# EAGLE schematic driver_piezo2 (EAGLE 7.1.0)
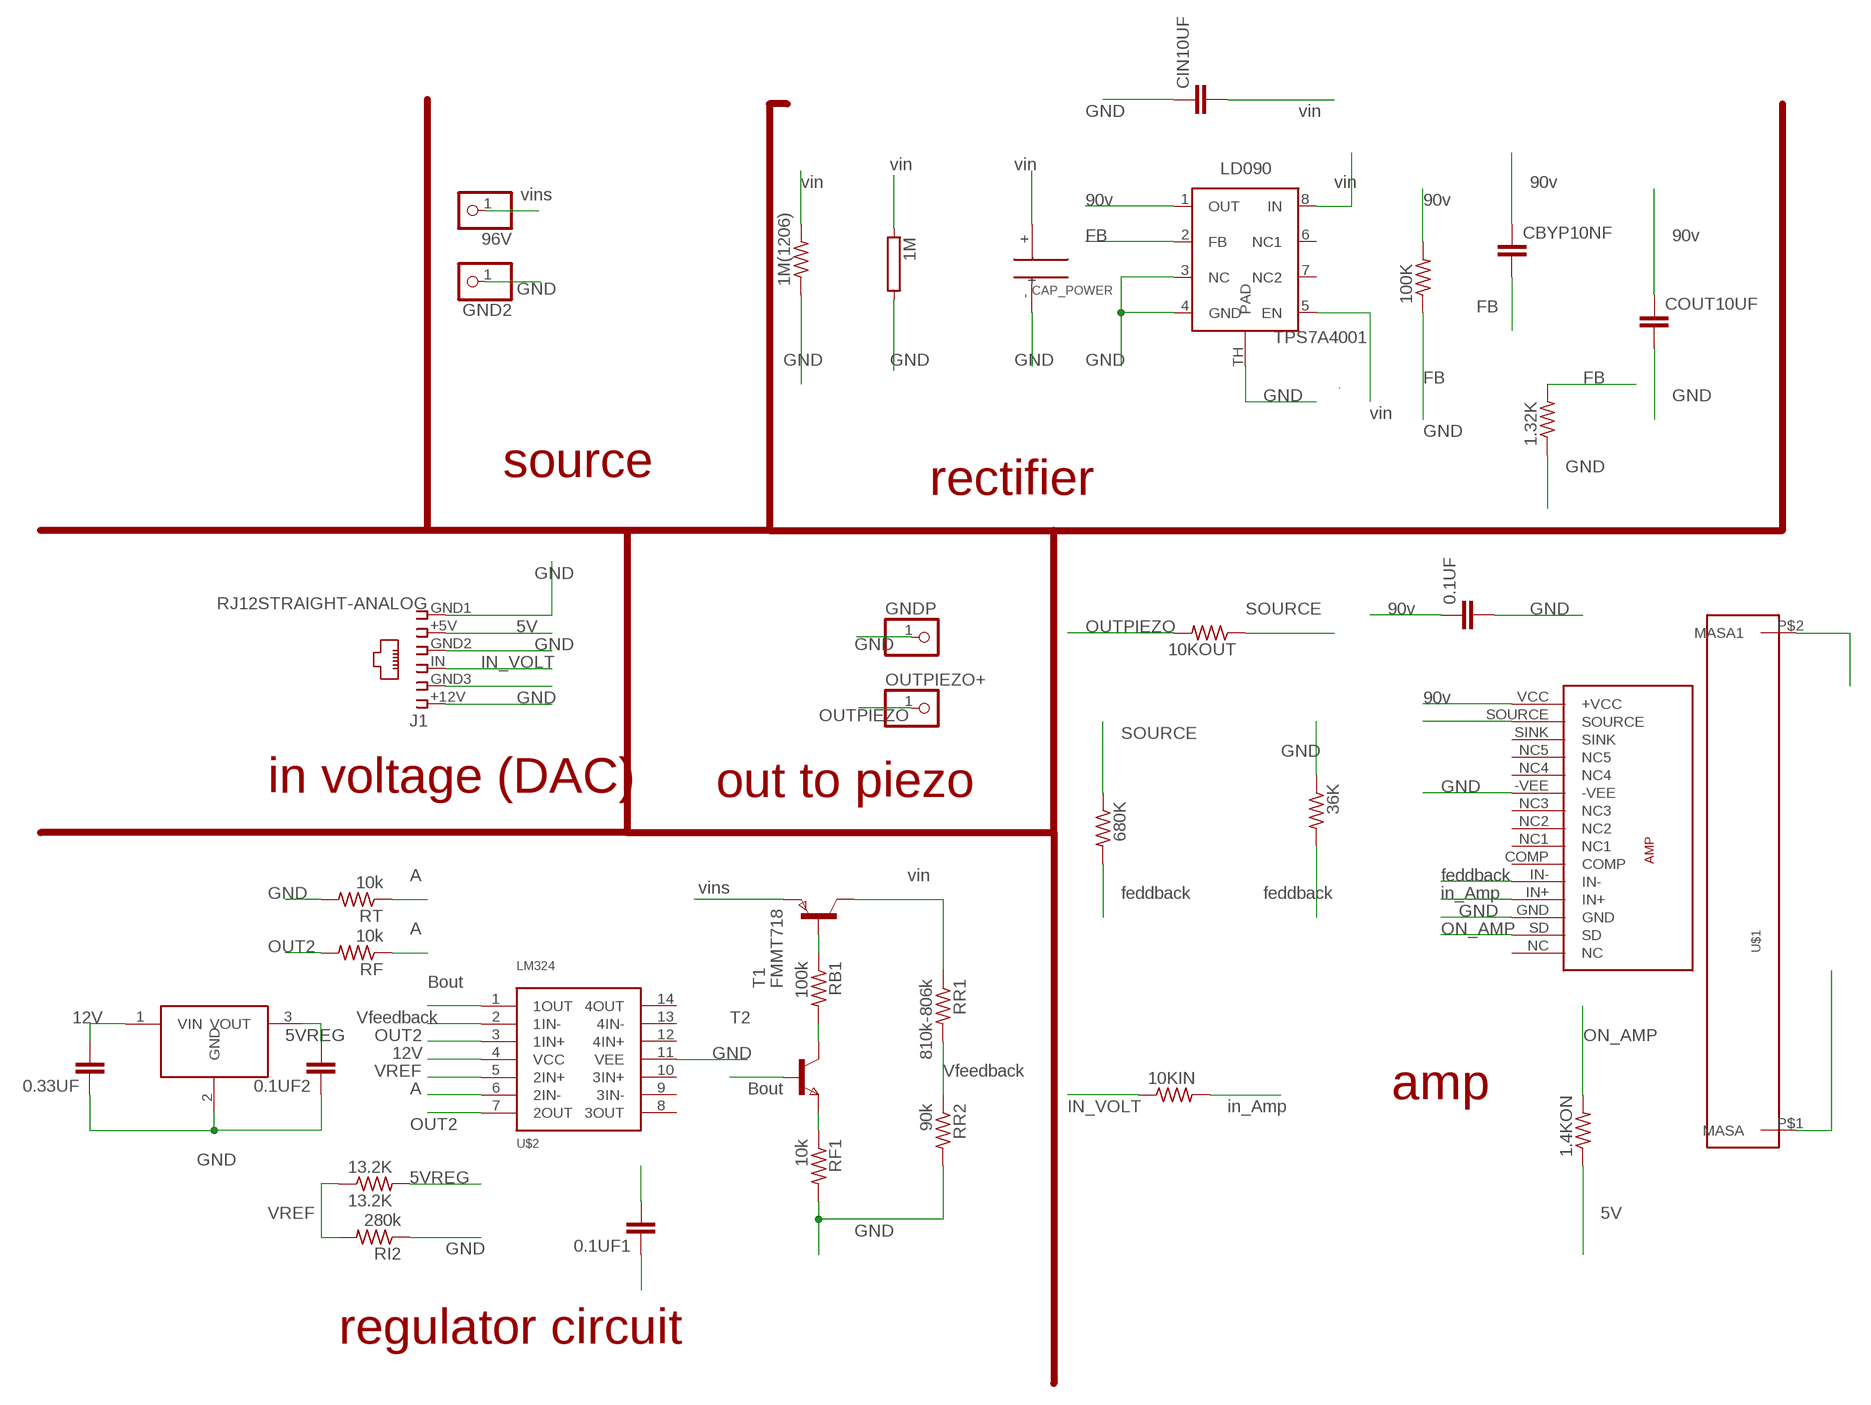
[diagram p0: schematic, sheet 1]

## Parts
0.1UF  C-EUC1206  [C1206]
0.1UF1  C-EUC1206  [C1206]
0.1UF2  C-EUC1206  [C1206]
0.33UF  C-EUC1206  [C1206]
1.4KON  R-US_R1206  [R1206]
1.32K  R-US_R1206  [R1206]
1M  RCA0002  [CA0002]
1M(1206)  R-US_R1206  [R1206]
10KIN  R-US_R1206  [R1206]
10KOUT  R-US_R1206  [R1206]
13.2K  13.2K  R-US_R1206  [R1206]
36K  R-US_R1206  [R1206]
96V  PINHD-1X1  [1X01]
100K  R-US_R1206  [R1206]
680K  R-US_R1206  [R1206]
AMP  POWER_AMP_LME49811TB  [POWER_AMP_LME49811TB]
CAP_POWER  CAP200VCAP200V  [CAP200V]
CBYP10NF  C-EUC1206  [C1206]
CIN10UF  C-EUC1206  [C1206]
COUT10UF  C-EUC1206  [C1206]
GND2  PINHD-1X1  [1X01]
GNDP  PINHD-1X1  [1X01]
J1  RJ12STRAIGHT-ANALOG  [RJ12-STRAIGHT-ANALOG]
LD090  TPS7A4001  [S-PDSO-G08]
OUTPIEZO+  PINHD-1X1  [1X01]
RB1  100k  R-US_R1206  [R1206]
RF  10k  R-US_R1206  [R1206]
RF1  10k  R-US_R1206  [R1206]
RI2  280k  R-US_R1206  [R1206]
RR1  810k-806k  R-US_R1206  [R1206]
RR2  90k  R-US_R1206  [R1206]
RT  10k  R-US_R1206  [R1206]
T1  FMMT718  [SOT-23]
T2  NPNSOT89  [SOT89]
U$1  DISIPADOR  [DISIPADOR]
U$2  LM324  [SO14]
U$3  7805  [TO220]

## Nets
1OUT: T2.1(B) U$2.1(1OUT)
2IN+: 13.2K.1 RI2.2 U$2.5(2IN+)
2IN-: RF.1 RT.1 U$2.6(2IN-)
2OUT: RF.2 U$2.3(1IN+) U$2.7(2OUT)
5V [5V]: 1.4KON.1 J1.+5V
5VOP: 0.1UF2.2 13.2K.2 U$3.3(VOUT)
12V: 0.1UF1.2 0.33UF.2 J1.+12V U$2.4(VCC) U$3.1(VIN)
B: 36K.2 680K.2 AMP.IN-
FB: 1.32K.2 100K.1 CBYP10NF.2 LD090.2(FB)
GND [GND]: 0.1UF1.1 0.1UF2.1 0.1UF.2 0.33UF.1 1.32K.1 1M(1206).1 1M.2 36K.1 AMP.-VEE AMP.GND CAP_POWER.- CIN10UF.1 COUT10UF.2 GND2.1 GNDP.1 J1.GND1 J1.GND2 J1.GND3 LD090.3(NC) LD090.4(GND) LD090.TH(PAD) RF1.2 RI2.1 RR2.2 RT.2 U$1.P$1(MASA) U$1.P$2(MASA1) U$2.11(VEE) U$3.2(GND)
IN_AMP: 10KIN.2 AMP.IN+
IN_VOLTAGE: 10KIN.1 J1.IN
N$3: RB1.2 T2.2(C) T2.2@1(C)
N$4: RB1.1 T1.3(B)
N$5: RF1.1 T2.3(E)
ON: 1.4KON.2 AMP.SD
OUT_PIEZO: 10KOUT.2 OUTPIEZO+.1
SOURCE: 10KOUT.1 680K.1 AMP.SOURCE
V90 [PWR]: 0.1UF.1 100K.2 AMP.VCC(+VCC) CBYP10NF.1 COUT10UF.1 LD090.1(OUT)
VF: RR1.2 RR2.1 U$2.2(1IN-)
VIN [VIN]: 1M(1206).2 1M.1 CAP_POWER.+ CIN10UF.2 LD090.5(EN) LD090.8(IN) RR1.1 T1.1(C)
VINS: 96V.1 T1.2(E)
Unconnected: AMP.COMP AMP.NC AMP.NC1 AMP.NC2 AMP.NC3 AMP.NC4 AMP.NC5 AMP.SINK LD090.6(NC1) LD090.7(NC2) U$2.8(3OUT) U$2.9(3IN-) U$2.10(3IN+) U$2.12(4IN+) U$2.13(4IN-) U$2.14(4OUT)

## Notes on the sheet
- GND | vin
- vin | vin
- vins | vin | vin | 90v
- 90v | 90v
- FB | 90v
- GND
- FB
- GND | GND | GND | GND
- FB | FB
- GND | GND
- vin
- GND
- source | GND
- rectifier
- GND
- SOURCE | 90v | GND
- 5V | OUTPIEZO
- GND | GND
- IN_VOLT
- GND | 90v
- OUTPIEZO
- SOURCE
- GND
- in voltage (DAC) | out to piezo | GND
- A | vins | vin | feddback
- GND | feddback | feddback | in_Amp
- GND
- A | ON_AMP
- OUT2
- Bout
- 12V | Vfeedback
- 5VREG | OUT2 | ON_AMP
- 12V | GND
- VREF | Vfeedback
- A | Bout | amp
- IN_VOLT | in_Amp
- OUT2
- GND
- 5VREG
- VREF | 5V
- GND
- GND
- regulator circuit

## Library data of the parts
0.1UF 0.1UF1 0.1UF2 0.33UF CBYP10NF CIN10UF COUT10UF = rcl:C-EU: CAPACITOR, European symbol
1.4KON 1.32K 1M(1206) 10KIN 10KOUT 13.2K 36K 100K 680K RB1 RF RF1 RI2 RR1 RR2 RT = resistor:R-US_: RESISTOR, American symbol
1M = resistor-power:R: Power Resitor; OC_FARNELL: unknown; OC_NEWARK: unknown
96V GND2 GNDP OUTPIEZO+ = pinhead:PINHD-1X1: PIN HEADER
AMP = PIEZO_LBR:POWER_AMP_LME49811TB
CAP_POWER = PIEZO_LBR:CAP200V
J1 = lpatiny:RJ12: CORCOM Modular RJ Jacks No Shield Source: www.tycoelectronics.com .. ENG_DS_1654001_1099_RJ_L_0507.pdf
LD090 = PIEZO_LBR:TPS7A4001
T1 = zetex:FMMT7*: PNP SILICON POWER (SWITCHING) TRANSISTORS SuperSOT Source: http://www.zetex.com/3.0/pdf/FMMT717.pdf; MPN: FMMT718; OC_FARNELL: 9526463RL; OC_NEWARK: 96K9968
T2 = zetex:NPNSOT89: NPN TRANSISTOR; MPN: DSS4540X-13; OC_FARNELL: 1710677; OC_NEWARK: 25R4564
U$1 = PIEZO_LBR:DISIPADOR
U$2 = PIEZO_LBR:LM324
U$3 = PIEZO_LBR:7805

## Net classes
1 PWR: width 0.127 mm, clearance 0.406 mm
2 GND: width 0.127 mm, clearance 0.762 mm
3 VIN: width 0.127 mm, clearance 0.406 mm
4 5V: width 0.406 mm, clearance 0.61 mm